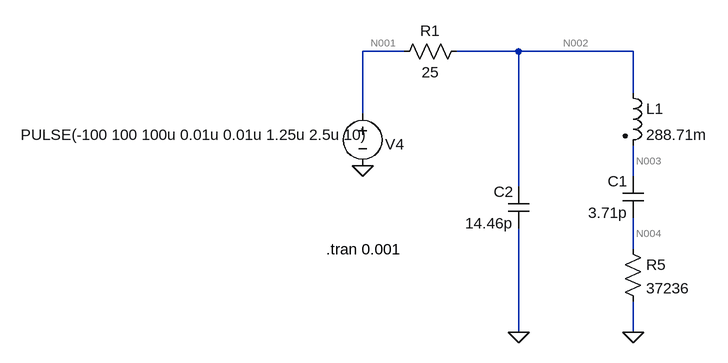
[diagram p0: schematic PZT.asc]
PZT.asc, the LTspice schematic file:
Version 4
SHEET 1 968 1120
WIRE -608 -176 -672 -176
WIRE -432 -176 -528 -176
WIRE -256 -176 -432 -176
WIRE -256 -112 -256 -176
WIRE -672 -80 -672 -176
WIRE -256 16 -256 -32
WIRE -432 32 -432 -176
WIRE -256 128 -256 80
WIRE -432 256 -432 96
WIRE -256 256 -256 208
FLAG -256 256 0
FLAG -672 0 0
FLAG -432 256 0
SYMBOL voltage -672 -96 R0
WINDOW 123 0 0 Left 2
WINDOW 39 0 0 Left 2
WINDOW 0 35 63 Left 2
WINDOW 3 -526 48 Left 2
SYMATTR InstName V4
SYMATTR Value PULSE(-100 100 100u 0.01u 0.01u 1.25u 2.5u 10)
SYMBOL res -272 112 R0
SYMATTR InstName R5
SYMATTR Value 37236
SYMBOL cap -240 80 R180
WINDOW 0 24 56 Left 2
WINDOW 3 24 8 Left 2
SYMATTR InstName C1
SYMATTR Value 3.71p
SYMBOL ind2 -272 -128 R0
SYMATTR InstName L1
SYMATTR Value 288.71m
SYMBOL cap -416 96 R180
WINDOW 0 24 56 Left 2
WINDOW 3 24 8 Left 2
SYMATTR InstName C2
SYMATTR Value 14.46p
SYMBOL res -512 -192 R90
WINDOW 0 0 56 VBottom 2
WINDOW 3 32 56 VTop 2
SYMATTR InstName R1
SYMATTR Value 25
TEXT -728 128 Left 2 !.tran 0.001

The netlist it stands for:
* PZT.asc
V4 N001 0 PULSE(-100 100 100u 0.01u 0.01u 1.25u 2.5u 10)
R5 N004 0 37236
C1 N004 N003 3.71p
L1 N002 N003 288.71m
C2 0 N002 14.46p
R1 N002 N001 25
.tran 0.001
.backanno
.end

* Results of the author's LTspice run, read from the files saved beside the schematic
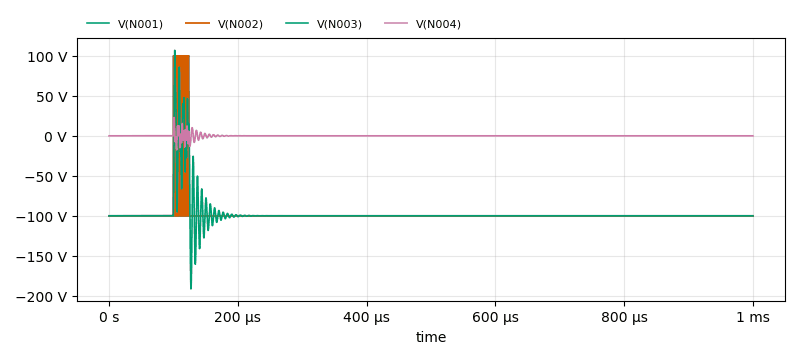
[diagram p1: Transient Analysis of PZT.asc, plotted from the saved traces]
* Transient Analysis, 1 run:
*   V(N001): min -100 V, max 100 V, average -97.48 V, rms 100 V, last -100 V
*   V(N002): min -100 V, max 100 V, average -97.48 V, rms 99.99 V, last -100 V
*   V(N003): min -191.3 V, max 106.8 V, average -97.47 V, rms 99.31 V, last -100 V
*   V(N004): min -17.73 V, max 23.07 V, average 369.7 µV, rms 1.605 V, last 0 V